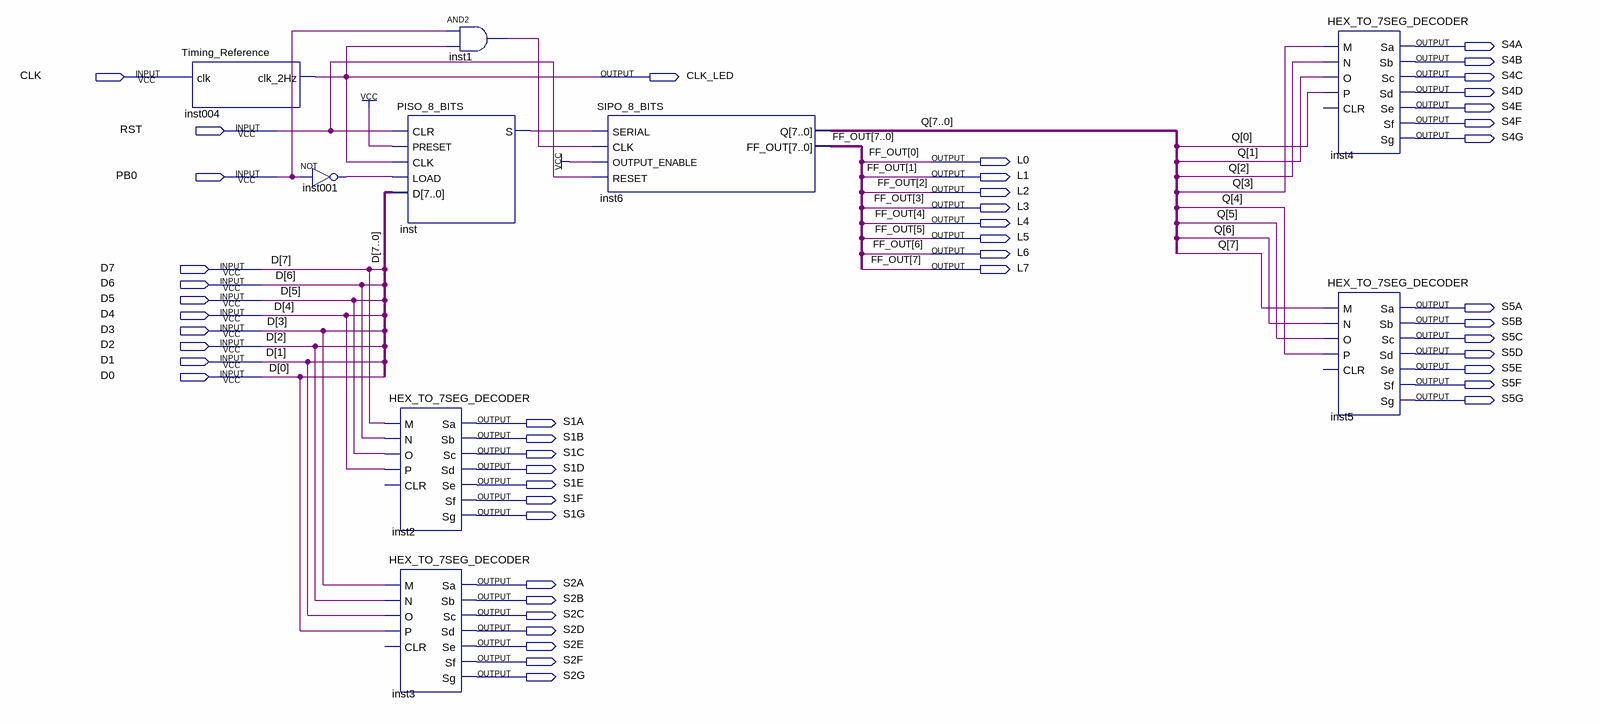
[diagram p0: schematic sheet]
// Quartus schematic Main.bdf as structural Verilog: 9 symbols, 48 pins
module Main (
  input  CLK,
  input  RST,
  input  PB0,
  input  D7,
  input  D6,
  input  D5,
  input  D4,
  input  D3,
  input  D2,
  input  D1,
  input  D0,
  output S4A,
  output S4B,
  output CLK_LED,
  output S4C,
  output S4D,
  output S4E,
  output S4F,
  output S4G,
  output L0,
  output L1,
  output L2,
  output L3,
  output L4,
  output L5,
  output L6,
  output L7,
  output S5A,
  output S5B,
  output S5C,
  output S5D,
  output S5E,
  output S5F,
  output S5G,
  output S1A,
  output S1B,
  output S1C,
  output S1D,
  output S1E,
  output S1F,
  output S1G,
  output S2A,
  output S2B,
  output S2C,
  output S2D,
  output S2E,
  output S2F,
  output S2G
);

  wire inst001_out, inst1_out, inst_s;
  wire [7:0] Q;

  Timing_Reference inst004 (.clk(CLK), .clk_2Hz(CLK_LED));
  not inst001 (inst001_out, PB0);
  PISO_8_BITS inst (
    .CLR(RST), .PRESET(1'b1), .CLK(CLK_LED), .LOAD(inst001_out), .D({D7, D6, D5, D4, D3, D2, D1, D0}),
    .S(inst_s));
  HEX_TO_7SEG_DECODER inst2 (
    .M(D7), .N(D6), .O(D5), .P(D4), .Sa(S1A), .Sb(S1B), .Sc(S1C), .Sd(S1D), .Se(S1E), .Sf(S1F), .Sg(S1G));  // open: CLR
  HEX_TO_7SEG_DECODER inst3 (
    .M(D3), .N(D2), .O(D1), .P(D0), .Sa(S2A), .Sb(S2B), .Sc(S2C), .Sd(S2D), .Se(S2E), .Sf(S2F), .Sg(S2G));  // open: CLR
  and inst1 (inst1_out, PB0, CLK_LED);
  SIPO_8_BITS inst6 (
    .SERIAL(inst_s), .CLK(inst1_out), .OUTPUT_ENABLE(1'b1), .RESET(RST), .Q(Q),
    .FF_OUT({L7, L6, L5, L4, L3, L2, L1, L0}));
  HEX_TO_7SEG_DECODER inst4 (
    .M(Q[3]), .N(Q[2]), .O(Q[1]), .P(Q[0]), .Sa(S4A), .Sb(S4B), .Sc(S4C), .Sd(S4D), .Se(S4E), .Sf(S4F),
    .Sg(S4G));  // open: CLR
  HEX_TO_7SEG_DECODER inst5 (
    .M(Q[7]), .N(Q[6]), .O(Q[5]), .P(Q[4]), .Sa(S5A), .Sb(S5B), .Sc(S5C), .Sd(S5D), .Se(S5E), .Sf(S5F),
    .Sg(S5G));  // open: CLR

  // Other names for the same wires on the sheet: FF_OUT[7:0] = {L7, L6, L5, L4, L3, L2, L1, L0}
endmodule
